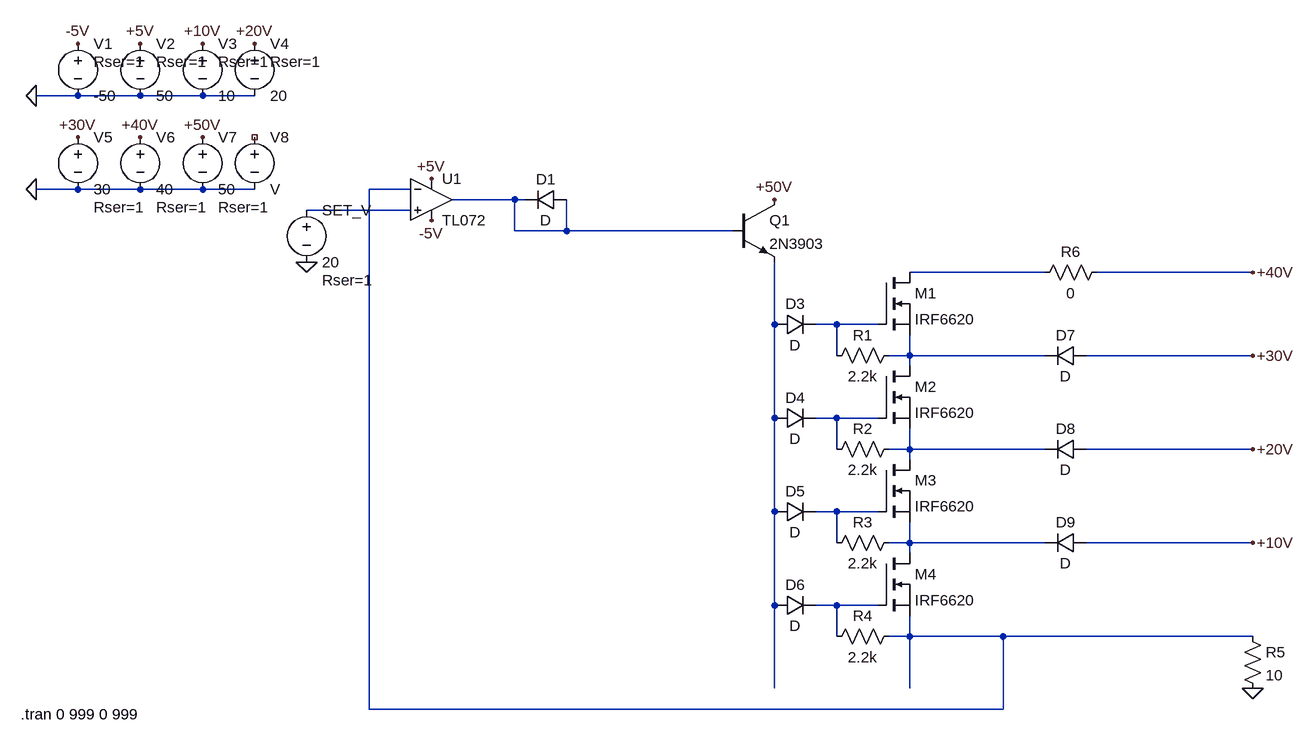
[diagram p0: schematic Draft1.asc]
Draft1.asc, the LTspice schematic file:
Version 4
SHEET 1 1412 956
WIRE -512 -32 -576 -32
WIRE -416 -32 -512 -32
WIRE -320 -32 -416 -32
WIRE -240 -32 -320 -32
WIRE -512 112 -576 112
WIRE -416 112 -512 112
WIRE -320 112 -416 112
WIRE -240 112 -320 112
WIRE 0 112 -64 112
WIRE 160 128 64 128
WIRE 176 128 160 128
WIRE 0 144 -160 144
WIRE 160 176 160 128
WIRE 240 176 240 128
WIRE 240 176 160 176
WIRE 496 176 240 176
WIRE 976 240 768 240
WIRE 1296 240 1056 240
WIRE 560 320 560 224
WIRE 656 320 624 320
WIRE 720 320 656 320
WIRE 656 368 656 320
WIRE 768 368 768 336
WIRE 768 368 736 368
WIRE 976 368 768 368
WIRE 1296 368 1040 368
WIRE 768 384 768 368
WIRE 560 464 560 320
WIRE 656 464 624 464
WIRE 720 464 656 464
WIRE 656 512 656 464
WIRE 768 512 768 480
WIRE 768 512 736 512
WIRE 976 512 768 512
WIRE 1296 512 1040 512
WIRE 768 528 768 512
WIRE 560 608 560 464
WIRE 656 608 624 608
WIRE 720 608 656 608
WIRE 656 656 656 608
WIRE 768 656 768 624
WIRE 768 656 736 656
WIRE 976 656 768 656
WIRE 1296 656 1040 656
WIRE 768 672 768 656
WIRE 560 752 560 608
WIRE 656 752 624 752
WIRE 720 752 656 752
WIRE 656 800 656 752
WIRE 768 800 768 768
WIRE 768 800 736 800
WIRE 912 800 768 800
WIRE 1296 800 912 800
WIRE 560 880 560 752
WIRE 768 880 768 800
WIRE -64 912 -64 112
WIRE 912 912 912 800
WIRE 912 912 -64 912
FLAG -160 224 0
FLAG -416 -112 +5V
FLAG -512 -112 -5V
FLAG 32 160 -5V
FLAG 32 96 +5V
FLAG -576 -32 0
FLAG -576 112 0
FLAG -320 -112 +10V
FLAG -240 -112 +20V
FLAG -512 32 +30V
FLAG -416 32 +40V
FLAG -320 32 +50V
FLAG 560 128 +50V
FLAG 1296 240 +40V
FLAG 1296 368 +30V
FLAG 1296 512 +20V
FLAG 1296 656 +10V
FLAG 1296 880 0
DATAFLAG 1104 800 ""
DATAFLAG 1104 800 ""
SYMBOL EXTRA\\AudioOpamp\\TI\\TL072 32 128 R0
SYMATTR InstName U1
SYMBOL voltage -160 128 R0
WINDOW 123 0 0 Left 0
WINDOW 39 24 124 Left 2
SYMATTR SpiceLine Rser=1
SYMATTR InstName SET_V
SYMATTR Value 20
SYMBOL voltage -512 -128 R0
WINDOW 123 0 0 Left 0
WINDOW 39 24 44 Left 2
SYMATTR SpiceLine Rser=1
SYMATTR InstName V1
SYMATTR Value -50
SYMBOL voltage -416 -128 R0
WINDOW 123 0 0 Left 0
WINDOW 39 24 44 Left 2
SYMATTR SpiceLine Rser=1
SYMATTR InstName V2
SYMATTR Value 50
SYMBOL diode 240 112 R90
WINDOW 0 0 32 VBottom 2
WINDOW 3 32 32 VTop 2
SYMATTR InstName D1
SYMBOL voltage -320 -128 R0
WINDOW 123 0 0 Left 0
WINDOW 39 24 44 Left 2
SYMATTR SpiceLine Rser=1
SYMATTR InstName V3
SYMATTR Value 10
SYMBOL voltage -240 -128 R0
WINDOW 123 0 0 Left 0
WINDOW 39 24 44 Left 2
SYMATTR SpiceLine Rser=1
SYMATTR InstName V4
SYMATTR Value 20
SYMBOL voltage -512 16 R0
WINDOW 123 0 0 Left 0
WINDOW 39 24 124 Left 2
SYMATTR SpiceLine Rser=1
SYMATTR InstName V5
SYMATTR Value 30
SYMBOL voltage -416 16 R0
WINDOW 123 0 0 Left 0
WINDOW 39 24 124 Left 2
SYMATTR SpiceLine Rser=1
SYMATTR InstName V6
SYMATTR Value 40
SYMBOL voltage -320 16 R0
WINDOW 123 0 0 Left 0
WINDOW 39 24 124 Left 2
SYMATTR SpiceLine Rser=1
SYMATTR InstName V7
SYMATTR Value 50
SYMBOL voltage -240 16 R0
SYMATTR InstName V8
SYMBOL npn 496 128 R0
SYMATTR InstName Q1
SYMATTR Value 2N3903
SYMBOL diode 560 336 R270
WINDOW 0 32 32 VTop 2
WINDOW 3 0 32 VBottom 2
SYMATTR InstName D3
SYMBOL diode 560 480 R270
WINDOW 0 32 32 VTop 2
WINDOW 3 0 32 VBottom 2
SYMATTR InstName D4
SYMBOL nmos 720 240 R0
SYMATTR InstName M1
SYMATTR Value IRF6620
SYMBOL nmos 720 384 R0
SYMATTR InstName M2
SYMATTR Value IRF6620
SYMBOL nmos 720 528 R0
SYMATTR InstName M3
SYMATTR Value IRF6620
SYMBOL nmos 720 672 R0
SYMATTR InstName M4
SYMATTR Value IRF6620
SYMBOL diode 560 624 R270
WINDOW 0 32 32 VTop 2
WINDOW 3 0 32 VBottom 2
SYMATTR InstName D5
SYMBOL diode 560 768 R270
WINDOW 0 32 32 VTop 2
WINDOW 3 0 32 VBottom 2
SYMATTR InstName D6
SYMBOL res 752 352 R90
WINDOW 0 0 56 VBottom 2
WINDOW 3 32 56 VTop 2
SYMATTR InstName R1
SYMATTR Value 2.2k
SYMBOL res 752 496 R90
WINDOW 0 0 56 VBottom 2
WINDOW 3 32 56 VTop 2
SYMATTR InstName R2
SYMATTR Value 2.2k
SYMBOL res 752 640 R90
WINDOW 0 0 56 VBottom 2
WINDOW 3 32 56 VTop 2
SYMATTR InstName R3
SYMATTR Value 2.2k
SYMBOL res 752 784 R90
WINDOW 0 0 56 VBottom 2
WINDOW 3 32 56 VTop 2
SYMATTR InstName R4
SYMATTR Value 2.2k
SYMBOL diode 1040 352 R90
WINDOW 0 0 32 VBottom 2
WINDOW 3 32 32 VTop 2
SYMATTR InstName D7
SYMBOL diode 1040 496 R90
WINDOW 0 0 32 VBottom 2
WINDOW 3 32 32 VTop 2
SYMATTR InstName D8
SYMBOL diode 1040 640 R90
WINDOW 0 0 32 VBottom 2
WINDOW 3 32 32 VTop 2
SYMATTR InstName D9
SYMBOL res 1280 784 R0
SYMATTR InstName R5
SYMATTR Value 10
SYMBOL res 1072 224 R90
WINDOW 0 0 56 VBottom 2
WINDOW 3 32 56 VTop 2
SYMATTR InstName R6
SYMATTR Value 0
TEXT -600 920 Left 2 !.tran 0 999 0 999

The netlist it stands for:
* Draft1.asc
* U1: TL072 (symbol EXTRA\AudioOpamp\TI\TL072 not available, pins judged from their places): In+=N003 In-=N001 V+=+5V V-=-5V OUT=N002
V§SET_V N003 0 20 Rser=1
V1 -5V 0 -50 Rser=1
V2 +5V 0 50 Rser=1
D1 N002 N002 D
V3 +10V 0 10 Rser=1
V4 +20V 0 20 Rser=1
V5 +30V 0 30 Rser=1
V6 +40V 0 40 Rser=1
V7 +50V 0 50 Rser=1
V8 NC_01 0 V
Q1 +50V N002 N005 0 2N3903
D3 N005 N006 D
D4 N005 N008 D
M1 N004 N006 N007 N007 IRF6620
M2 N007 N008 N009 N009 IRF6620
M3 N009 N010 N011 N011 IRF6620
M4 N011 N012 N001 N001 IRF6620
D5 N005 N010 D
D6 N005 N012 D
R1 N007 N006 2.2k
R2 N009 N008 2.2k
R3 N011 N010 2.2k
R4 N001 N012 2.2k
D7 +30V N007 D
D8 +20V N009 D
D9 +10V N011 D
R5 N001 0 10
R6 +40V N004 0
.model D D
.lib standard.dio
.model NPN NPN
.model PNP PNP
.lib standard.bjt
.model NMOS NMOS
.model PMOS PMOS
.lib standard.mos
.tran 0 999 0 999
.backanno
.end